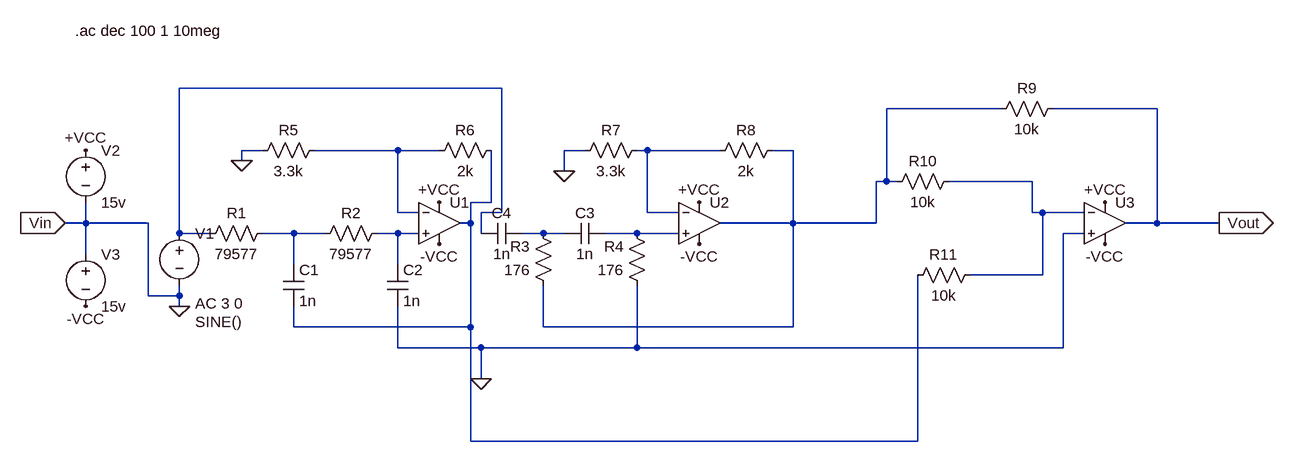
[diagram p0: schematic BSF.asc]
BSF.asc, the LTspice schematic file:
Version 4
SHEET 1 1312 680
WIRE 96 -64 -400 -64
WIRE 864 -32 688 -32
WIRE 1104 -32 944 -32
WIRE -272 32 -304 32
WIRE -64 32 -192 32
WIRE 0 32 -64 32
WIRE 224 32 192 32
WIRE 320 32 304 32
WIRE 432 32 320 32
WIRE 544 32 512 32
WIRE -304 48 -304 32
WIRE 192 64 192 32
WIRE 688 80 688 -32
WIRE 688 80 672 80
WIRE 704 80 688 80
WIRE 912 80 784 80
WIRE 80 112 80 32
WIRE 80 112 48 112
WIRE -64 128 -64 32
WIRE -32 128 -64 128
WIRE 96 128 96 -64
WIRE 96 128 64 128
WIRE 320 128 320 32
WIRE 368 128 320 128
WIRE 912 128 912 80
WIRE 928 128 912 128
WIRE 992 128 928 128
WIRE -544 144 -544 112
WIRE -544 144 -576 144
WIRE -448 144 -544 144
WIRE 48 144 48 112
WIRE 48 144 32 144
WIRE 544 144 544 32
WIRE 544 144 432 144
WIRE 672 144 672 80
WIRE 672 144 544 144
WIRE 1104 144 1104 -32
WIRE 1104 144 1056 144
WIRE 1200 144 1104 144
WIRE -400 160 -400 -64
WIRE -352 160 -400 160
WIRE -224 160 -272 160
WIRE -176 160 -224 160
WIRE -64 160 -96 160
WIRE -32 160 -64 160
WIRE 64 160 64 128
WIRE 160 160 128 160
WIRE 192 160 160 160
WIRE 304 160 256 160
WIRE 368 160 304 160
WIRE 992 160 960 160
WIRE -544 192 -544 144
WIRE -224 208 -224 160
WIRE -64 208 -64 160
WIRE 928 224 928 128
WIRE 928 224 816 224
WIRE -448 256 -448 144
WIRE -400 256 -400 240
WIRE -400 256 -448 256
WIRE -400 272 -400 256
WIRE -224 304 -224 272
WIRE 48 304 48 144
WIRE 48 304 -224 304
WIRE 160 304 160 240
WIRE 544 304 544 144
WIRE 544 304 160 304
WIRE -64 336 -64 272
WIRE 64 336 -64 336
WIRE 304 336 304 240
WIRE 304 336 64 336
WIRE 960 336 960 160
WIRE 960 336 304 336
WIRE 64 384 64 336
WIRE 48 480 48 304
WIRE 736 480 736 224
WIRE 736 480 48 480
FLAG -304 48 0
FLAG 192 64 0
FLAG 64 384 0
FLAG -400 272 0
FLAG -544 32 +VCC
FLAG -544 272 -VCC
FLAG 0 112 +VCC
FLAG 400 112 +VCC
FLAG 0 176 -VCC
FLAG 400 176 -VCC
FLAG 1200 144 Vout
IOPIN 1200 144 Out
FLAG -576 144 Vin
IOPIN -576 144 In
FLAG 1024 112 +VCC
FLAG 1024 176 -VCC
SYMBOL res -256 144 R90
WINDOW 0 0 56 VBottom 2
WINDOW 3 32 56 VTop 2
SYMATTR InstName R1
SYMATTR Value 79577
SYMBOL res -80 144 R90
WINDOW 0 0 56 VBottom 2
WINDOW 3 32 56 VTop 2
SYMATTR InstName R2
SYMATTR Value 79577
SYMBOL res 176 256 R180
WINDOW 0 36 76 Left 2
WINDOW 3 36 40 Left 2
SYMATTR InstName R3
SYMATTR Value 176
SYMBOL res 320 256 R180
WINDOW 0 36 76 Left 2
WINDOW 3 36 40 Left 2
SYMATTR InstName R4
SYMATTR Value 176
SYMBOL cap -240 208 R0
SYMATTR InstName C1
SYMATTR Value 1n
SYMBOL cap -80 208 R0
SYMATTR InstName C2
SYMATTR Value 1n
SYMBOL cap 256 144 R90
WINDOW 0 0 32 VBottom 2
WINDOW 3 32 32 VTop 2
SYMATTR InstName C3
SYMATTR Value 1n
SYMBOL cap 128 144 R90
WINDOW 0 0 32 VBottom 2
WINDOW 3 32 32 VTop 2
SYMATTR InstName C4
SYMATTR Value 1n
SYMBOL res -176 16 R90
WINDOW 0 0 56 VBottom 2
WINDOW 3 32 56 VTop 2
SYMATTR InstName R5
SYMATTR Value 3.3k
SYMBOL res 96 16 R90
WINDOW 0 0 56 VBottom 2
WINDOW 3 32 56 VTop 2
SYMATTR InstName R6
SYMATTR Value 2k
SYMBOL res 320 16 R90
WINDOW 0 0 56 VBottom 2
WINDOW 3 32 56 VTop 2
SYMATTR InstName R7
SYMATTR Value 3.3k
SYMBOL res 528 16 R90
WINDOW 0 0 56 VBottom 2
WINDOW 3 32 56 VTop 2
SYMATTR InstName R8
SYMATTR Value 2k
SYMBOL voltage -400 144 R0
WINDOW 3 24 152 Left 2
WINDOW 123 24 124 Left 2
WINDOW 39 0 0 Left 0
SYMATTR Value SINE()
SYMATTR Value2 AC 3 0
SYMATTR InstName V1
SYMBOL voltage -544 16 R0
WINDOW 123 0 0 Left 0
WINDOW 39 0 0 Left 0
SYMATTR InstName V2
SYMATTR Value 15v
SYMBOL voltage -544 176 R0
WINDOW 123 0 0 Left 0
WINDOW 39 0 0 Left 0
SYMATTR InstName V3
SYMATTR Value 15v
SYMBOL OpAmps\\UniversalOpAmp1 0 144 R0
SYMATTR InstName U1
SYMBOL OpAmps\\UniversalOpAmp1 400 144 R0
SYMATTR InstName U2
SYMBOL OpAmps\\UniversalOpAmp 1024 144 R0
SYMATTR InstName U3
SYMBOL res 960 -48 R90
WINDOW 0 0 56 VBottom 2
WINDOW 3 32 56 VTop 2
SYMATTR InstName R9
SYMATTR Value 10k
SYMBOL res 800 64 R90
WINDOW 0 0 56 VBottom 2
WINDOW 3 32 56 VTop 2
SYMATTR InstName R10
SYMATTR Value 10k
SYMBOL res 832 208 R90
WINDOW 0 0 56 VBottom 2
WINDOW 3 32 56 VTop 2
SYMATTR InstName R11
SYMATTR Value 10k
TEXT -560 -152 Left 2 !.ac dec 100 1 10meg

The netlist it stands for:
* BSF.asc
R1 N007 N001 79577
R2 N008 N007 79577
R3 N002 N009 176
R4 0 N010 176
C1 N007 N006 1n
C2 N008 0 1n
C3 N010 N009 1n
C4 N009 N001 1n
R5 N003 0 3.3k
R6 N006 N003 2k
R7 N004 0 3.3k
R8 N002 N004 2k
V1 N001 0 SINE() AC 3 0
V2 +VCC 0 15v
V3 0 -VCC 15v
XU1 N008 N003 +VCC -VCC N006 level1 Avol=1Meg GBW=10Meg Vos=0 En=0 Enk=0 In=0 Ink=0 Rin=500Meg  ; pins In+ In- V+ V- OUT
XU2 N010 N004 +VCC -VCC N002 level1 Avol=1Meg GBW=10Meg Vos=0 En=0 Enk=0 In=0 Ink=0 Rin=500Meg  ; pins In+ In- V+ V- OUT
XU3 0 N005 +VCC -VCC Vout level1 Avol=1Meg GBW=10Meg Vos=0 En=0 Enk=0 In=0 Ink=0 Rin=500Meg  ; pins In+ In- V+ V- OUT
R9 Vout N002 10k
R10 N005 N002 10k
R11 N005 N006 10k
.ac dec 100 1 10meg
.lib UniversalOpAmp1.lib
.backanno
.end